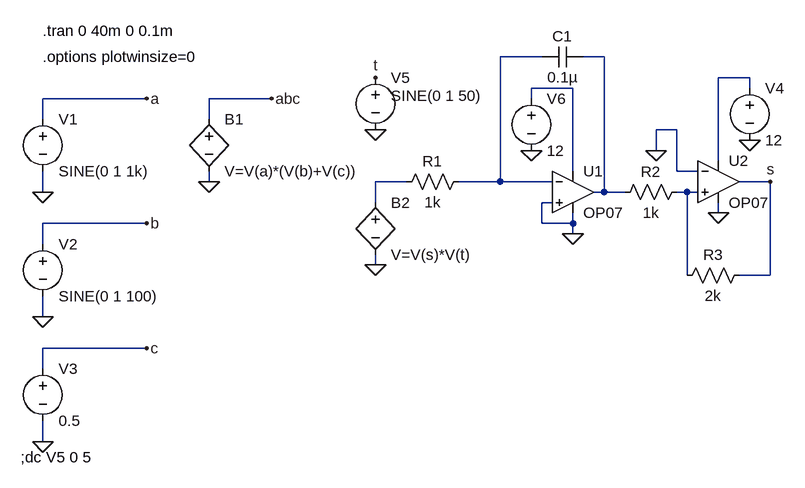
[diagram p0: schematic Multiplizierer.asc]
Multiplizierer.asc, the LTspice schematic file:
Version 4
SHEET 1 1368 680
WIRE 992 -144 928 -144
WIRE 1088 -144 1056 -144
WIRE 1312 -112 1264 -112
WIRE 1040 -96 976 -96
WIRE 1312 -96 1312 -112
WIRE 384 -80 224 -80
WIRE 576 -80 480 -80
WIRE 976 -80 976 -96
WIRE 224 -48 224 -80
WIRE 480 -48 480 -80
WIRE 1200 -32 1168 -32
WIRE 1168 0 1168 -32
WIRE 1264 16 1264 -112
WIRE 1040 32 1040 -96
WIRE 1200 32 1200 -32
WIRE 1232 32 1200 32
WIRE 480 48 480 32
WIRE 784 48 736 48
WIRE 928 48 928 -144
WIRE 928 48 864 48
WIRE 1008 48 928 48
WIRE 1344 48 1296 48
WIRE 224 64 224 32
WIRE 1088 64 1088 -144
WIRE 1088 64 1072 64
WIRE 1120 64 1088 64
WIRE 1216 64 1200 64
WIRE 1232 64 1216 64
WIRE 736 80 736 48
WIRE 1008 80 992 80
WIRE 1264 96 1264 80
WIRE 384 112 224 112
WIRE 992 112 992 80
WIRE 1040 112 1040 96
WIRE 1040 112 992 112
WIRE 1040 128 1040 112
WIRE 224 144 224 112
WIRE 736 176 736 160
WIRE 1216 192 1216 64
WIRE 1344 192 1344 48
WIRE 1344 192 1296 192
WIRE 224 256 224 224
WIRE 384 304 224 304
WIRE 224 336 224 304
WIRE 224 448 224 416
FLAG 224 64 0
FLAG 224 256 0
FLAG 480 48 0
FLAG 224 448 0
FLAG 384 -80 a
FLAG 384 112 b
FLAG 384 304 c
FLAG 576 -80 abc
FLAG 736 176 0
FLAG 1168 0 0
FLAG 1344 48 s
FLAG 1264 96 0
FLAG 1040 128 0
FLAG 1312 -16 0
FLAG 736 -32 0
FLAG 736 -112 t
FLAG 976 0 0
SYMBOL voltage 224 -64 R0
WINDOW 123 0 0 Left 2
WINDOW 39 0 0 Left 2
SYMATTR InstName V1
SYMATTR Value SINE(0 1 1k)
SYMBOL voltage 224 128 R0
SYMATTR InstName V2
SYMATTR Value SINE(0 1 100)
SYMBOL bv 480 -64 R0
SYMATTR InstName B1
SYMATTR Value V=V(a)*(V(b)+V(c))
SYMBOL voltage 224 320 R0
SYMATTR InstName V3
SYMATTR Value 0.5
SYMBOL res 880 32 R90
WINDOW 0 0 56 VBottom 2
WINDOW 3 32 56 VTop 2
SYMATTR InstName R1
SYMATTR Value 1k
SYMBOL bv 736 64 R0
SYMATTR InstName B2
SYMATTR Value V=V(s)*V(t)
SYMBOL Opamps\\OP07 1040 0 R0
SYMATTR InstName U1
SYMBOL cap 1056 -160 R90
WINDOW 0 0 32 VBottom 2
WINDOW 3 32 32 VTop 2
SYMATTR InstName C1
SYMATTR Value 0.1µ
SYMBOL res 1216 48 R90
WINDOW 0 0 56 VBottom 2
WINDOW 3 32 56 VTop 2
SYMATTR InstName R2
SYMATTR Value 1k
SYMBOL Opamps\\OP07 1264 -16 R0
SYMATTR InstName U2
SYMBOL res 1312 176 R90
WINDOW 0 0 56 VBottom 2
WINDOW 3 32 56 VTop 2
SYMATTR InstName R3
SYMATTR Value 2k
SYMBOL voltage 1312 -112 R0
WINDOW 123 0 0 Left 0
WINDOW 39 0 0 Left 0
SYMATTR InstName V4
SYMATTR Value 12
SYMBOL voltage 736 -128 R0
WINDOW 3 24 44 Left 2
WINDOW 123 24 44 Left 2
WINDOW 39 0 0 Left 0
SYMATTR InstName V5
SYMATTR Value SINE(0 1 50)
SYMBOL voltage 976 -96 R0
WINDOW 123 0 0 Left 0
WINDOW 39 0 0 Left 0
SYMATTR InstName V6
SYMATTR Value 12
TEXT 224 -184 Left 2 !.tran 0 40m 0 0.1m
TEXT 224 -144 Left 2 !.options plotwinsize=0
TEXT 190 472 Left 2 !;dc V5 0 5

The netlist it stands for:
* Multiplizierer.asc
V1 a 0 SINE(0 1 1k)
V2 b 0 SINE(0 1 100)
B1 abc 0 V=V(a)*(V(b)+V(c))
V3 c 0 0.5
R1 N001 N005 1k
B2 N005 0 V=V(s)*V(t)
XU1 0 N001 N004 0 N002 LT1001  ; OP07, pins In+ In- V+ V- OUT
C1 N002 N001 0.1µ
R2 N006 N002 1k
XU2 N006 0 N003 0 s LT1001  ; OP07, pins In+ In- V+ V- OUT
R3 s N006 2k
V4 N003 0 12
V5 t 0 SINE(0 1 50)
V6 N004 0 12
.tran 0 40m 0 0.1m
.options plotwinsize=0
;dc V5 0 5
.lib LTC.lib
.backanno
.end